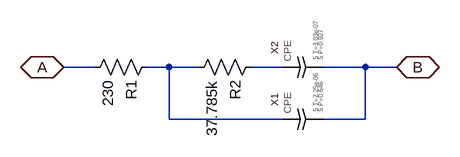
[diagram p0: schematic randles.asc]
randles.asc, the LTspice schematic file:
Version 4
Sheet 1 1212 680
FLAG 0 0 A
IOPIN 0 0 BiDir
FLAG 512 0 B
IOPIN 512 0 BiDir
SYMBOL res 144 -16 R90
SYMATTR InstName R1
SYMATTR Value 230
SYMBOL res 304 -16 R90
SYMATTR InstName R2
SYMATTR Value 37.785k
SYMBOL cpe1 336 96 R270
SYMATTR InstName X1
SYMBOL cpe2 336 16 R270
SYMATTR InstName X2
WIRE 0 0 48 0
WIRE 128 0 208 0
WIRE 288 0 336 0
WIRE 400 0 512 0
WIRE 162 0 162 80
WIRE 162 80 336 80
WIRE 400 80 464 80
WIRE 464 80 464 0

The netlist it stands for:
* randles.asc
R1 N001 A 230
R2 N002 N001 37.785k
XX1 N001 B cpe1  ; pins A B
XX2 N002 B cpe2  ; pins A B
.backanno
.end